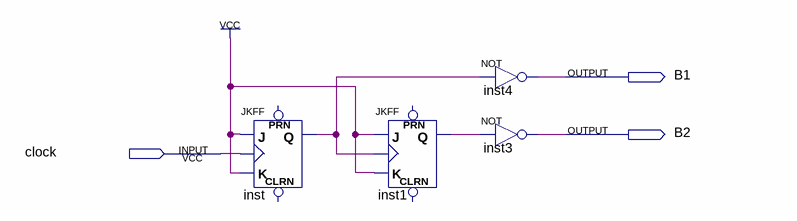
[diagram p0: schematic sheet]
// Quartus schematic contador.bdf as structural Verilog: 4 symbols, 3 pins
module contador (
  input  clock,
  output B1,
  output B2
);

  wire inst1_q, inst_q;

  JKFF inst (.K(1'b1), .J(1'b1), .CLK(clock), .Q(inst_q));  // open: PRN, CLRN
  JKFF inst1 (.K(1'b1), .J(1'b1), .CLK(inst_q), .Q(inst1_q));  // open: PRN, CLRN
  not inst4 (B1, inst_q);
  not inst3 (B2, inst1_q);
endmodule
